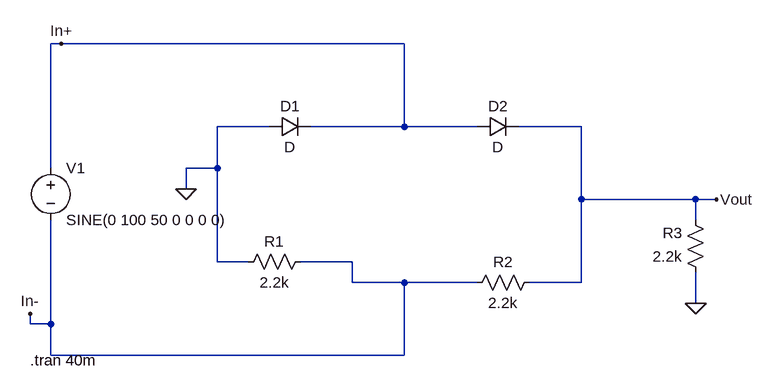
[diagram p0: schematic Assignment-3.2 Diode Application (LTSpice).asc]
Assignment-3.2 Diode Application (LTSpice).asc, the LTspice schematic file:
Version 4.1
SHEET 1 1080 680
WIRE 0 -48 -16 -48
WIRE 528 -48 0 -48
WIRE 320 80 240 80
WIRE 528 80 528 -48
WIRE 528 80 384 80
WIRE 640 80 528 80
WIRE 800 80 704 80
WIRE -16 144 -16 -48
WIRE 240 144 240 80
WIRE 240 144 192 144
WIRE 192 176 192 144
WIRE 800 192 800 80
WIRE 976 192 800 192
WIRE 1008 192 976 192
WIRE 976 224 976 192
WIRE 240 288 240 144
WIRE 288 288 240 288
WIRE 448 288 368 288
WIRE 448 320 448 288
WIRE 528 320 448 320
WIRE 640 320 528 320
WIRE 800 320 800 192
WIRE 800 320 720 320
WIRE 976 352 976 304
WIRE -48 384 -48 368
WIRE -16 384 -16 224
WIRE -16 384 -48 384
WIRE -16 432 -16 384
WIRE 528 432 528 320
WIRE 528 432 -16 432
FLAG 192 176 0
FLAG 976 352 0
FLAG 1008 192 Vout
FLAG 0 -48 In+
FLAG -48 368 In-
SYMBOL voltage -16 128 R0
WINDOW 123 0 0 Left 0
WINDOW 39 0 0 Left 0
SYMATTR InstName V1
SYMATTR Value SINE(0 100 50 0 0 0 0)
SYMBOL diode 320 96 R270
WINDOW 0 32 32 VTop 2
WINDOW 3 0 32 VBottom 2
SYMATTR InstName D1
SYMBOL diode 640 96 R270
WINDOW 0 32 32 VTop 2
WINDOW 3 0 32 VBottom 2
SYMATTR InstName D2
SYMBOL res 384 272 R90
WINDOW 0 0 56 VBottom 2
WINDOW 3 32 56 VTop 2
SYMATTR InstName R1
SYMATTR Value 2.2k
SYMBOL res 736 304 R90
WINDOW 0 0 56 VBottom 2
WINDOW 3 32 56 VTop 2
SYMATTR InstName R2
SYMATTR Value 2.2k
SYMBOL res 992 320 R180
WINDOW 0 36 76 Left 2
WINDOW 3 36 40 Left 2
SYMATTR InstName R3
SYMATTR Value 2.2k
TEXT -48 440 Left 2 !.tran 40m

The netlist it stands for:
* Assignment-3.2 Diode Application (LTSpice).asc
V1 In+ In- SINE(0 100 50 0 0 0 0)
D1 0 In+ D
D2 In+ Vout D
R1 In- 0 2.2k
R2 Vout In- 2.2k
R3 0 Vout 2.2k
.model D D
.lib standard.dio
.tran 40m
.backanno
.end